# EAGLE design PCB design (EAGLE 9.5.2)
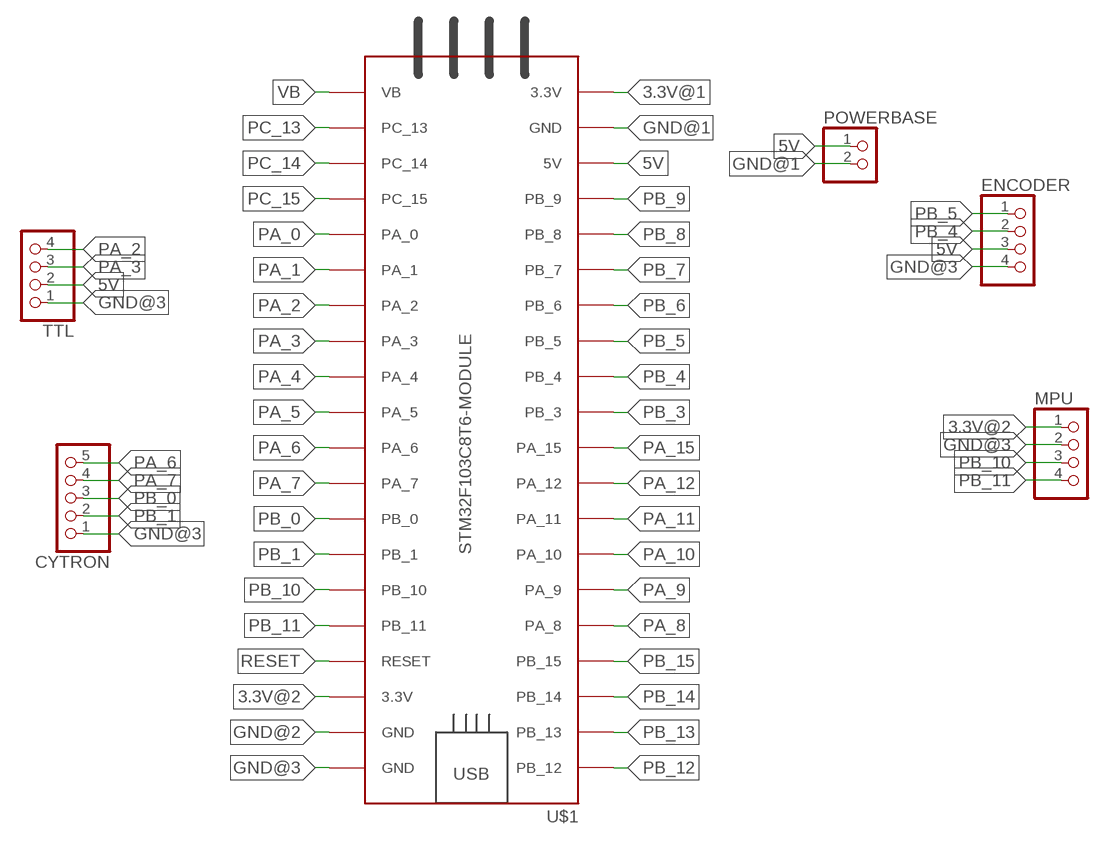
[diagram p0: schematic, sheet 1]

## Parts
CYTRON  PINHD-1X5  [1X05]
ENCODER  PINHD-1X4  [1X04]
MPU  PINHD-1X4  [1X04]
POWERBASE  PINHD-1X2  [1X02]
TTL  PINHD-1X4  [1X04]
U$1  STM32F103C8T6-MODULE  [STM32F103C8T6-MODULE]

## Nets
3.3V@1: U$1.3.3V_1(3.3V)
3.3V@2: MPU.1 U$1.3.3V_2(3.3V)
5V: ENCODER.3 POWERBASE.1 TTL.2 U$1.5V
GND@1: POWERBASE.2 U$1.GND_1(GND)
GND@2: U$1.GND_2(GND)
GND@3: CYTRON.1 ENCODER.4 MPU.2 TTL.1 U$1.GND_3(GND)
PA_0: U$1.PA_0
PA_1: U$1.PA_1
PA_2: TTL.4 U$1.PA_2
PA_3: TTL.3 U$1.PA_3
PA_4: U$1.PA_4
PA_5: U$1.PA_5
PA_6: CYTRON.5 U$1.PA_6
PA_7: CYTRON.4 U$1.PA_7
PA_8: U$1.PA_8
PA_9: U$1.PA_9
PA_10: U$1.PA_10
PA_11: U$1.PA_11
PA_12: U$1.PA_12
PA_15: U$1.PA_15
PB_0: CYTRON.3 U$1.PB_0
PB_1: CYTRON.2 U$1.PB_1
PB_3: U$1.PB_3
PB_4: ENCODER.2 U$1.PB_4
PB_5: ENCODER.1 U$1.PB_5
PB_6: U$1.PB_6
PB_7: U$1.PB_7
PB_8: U$1.PB_8
PB_9: U$1.PB_9
PB_10: MPU.3 U$1.PB_10
PB_11: MPU.4 U$1.PB_11
PB_12: U$1.PB_12
PB_13: U$1.PB_13
PB_14: U$1.PB_14
PB_15: U$1.PB_15
PC_13: U$1.PC_13
PC_14: U$1.PC_14
PC_15: U$1.PC_15
RESET: U$1.RESET
VB: U$1.VB

## Library data of the parts
CYTRON = MIA_LIBRARY-2-2-2:PINHD-1X5: PIN HEADER
ENCODER MPU TTL = MIA_LIBRARY-2-2-2:PINHD-1X4: PIN HEADER
POWERBASE = MIA_LIBRARY-2-2-2:PINHD-1X2: PIN HEADER
U$1 = MIA_LIBRARY-2-2-2:STM32F103C8T6-MODULE: STM32F103C8T6 module with ARM Cortex-3, 20kB SRAM, 64kB Flash, 72MHz

## Board
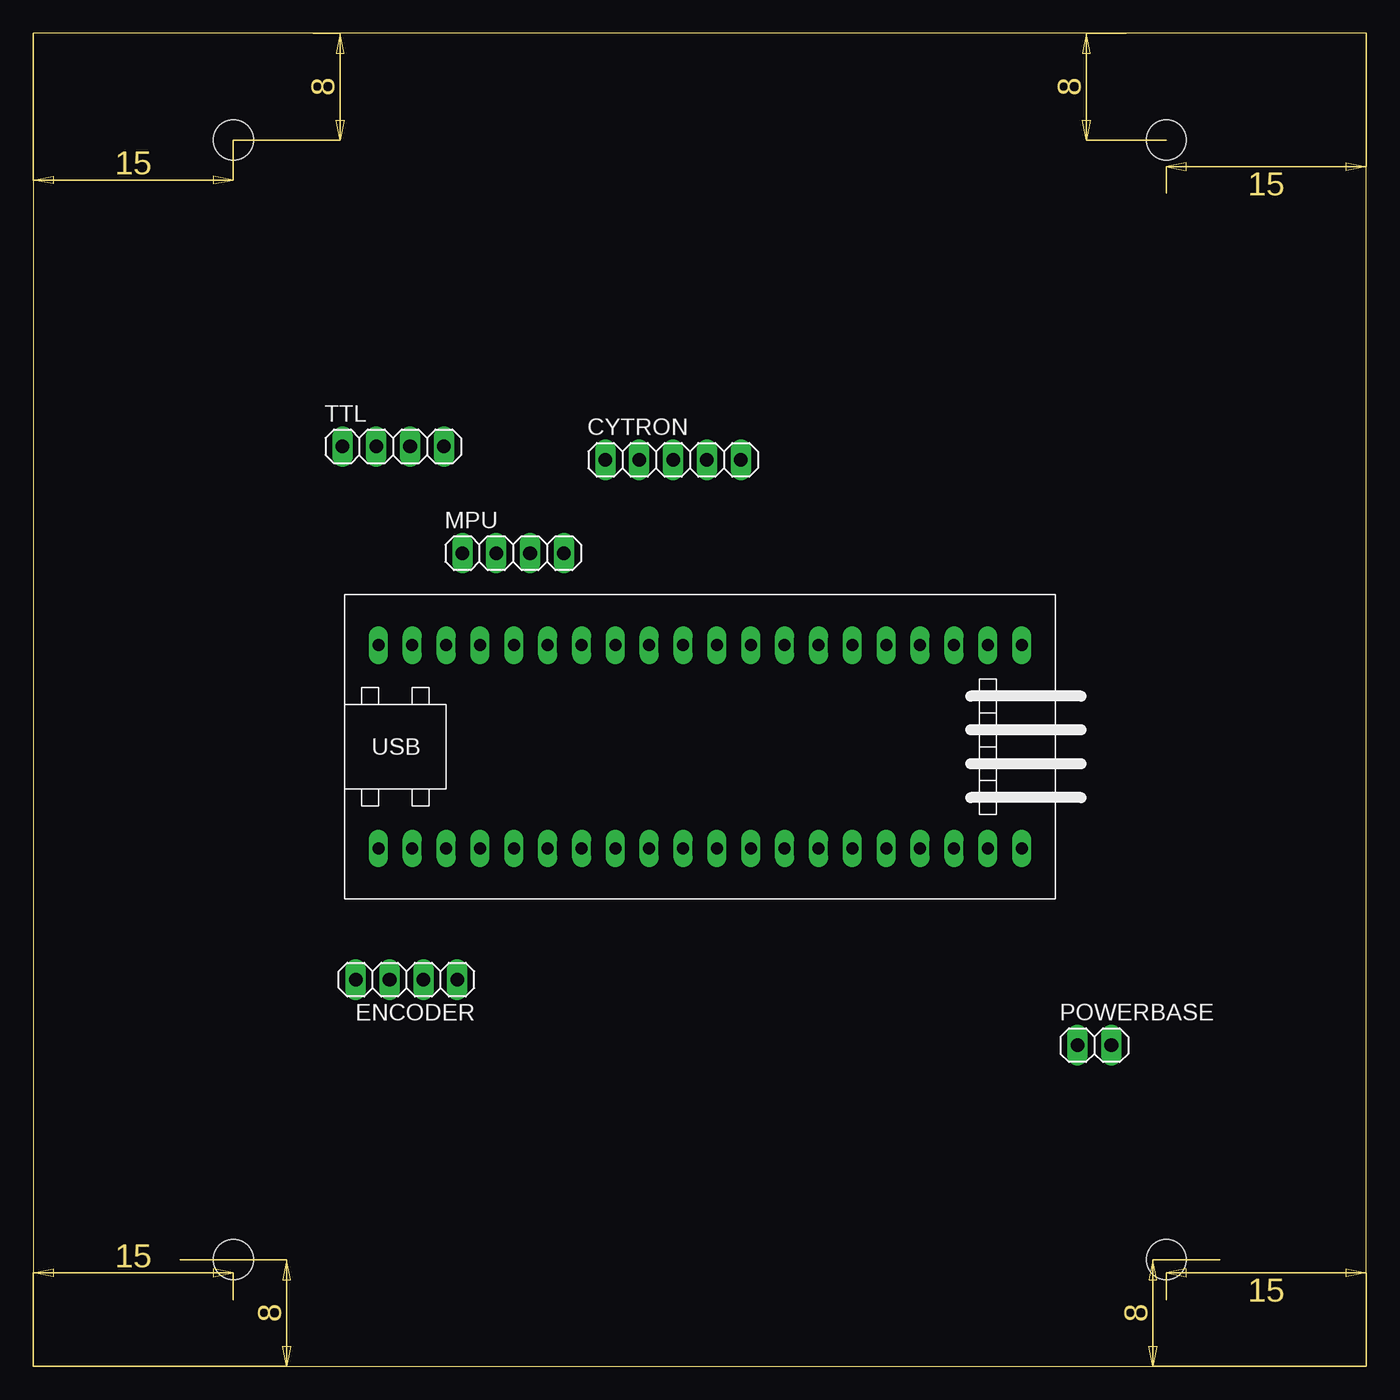
[diagram p1: board, top side]
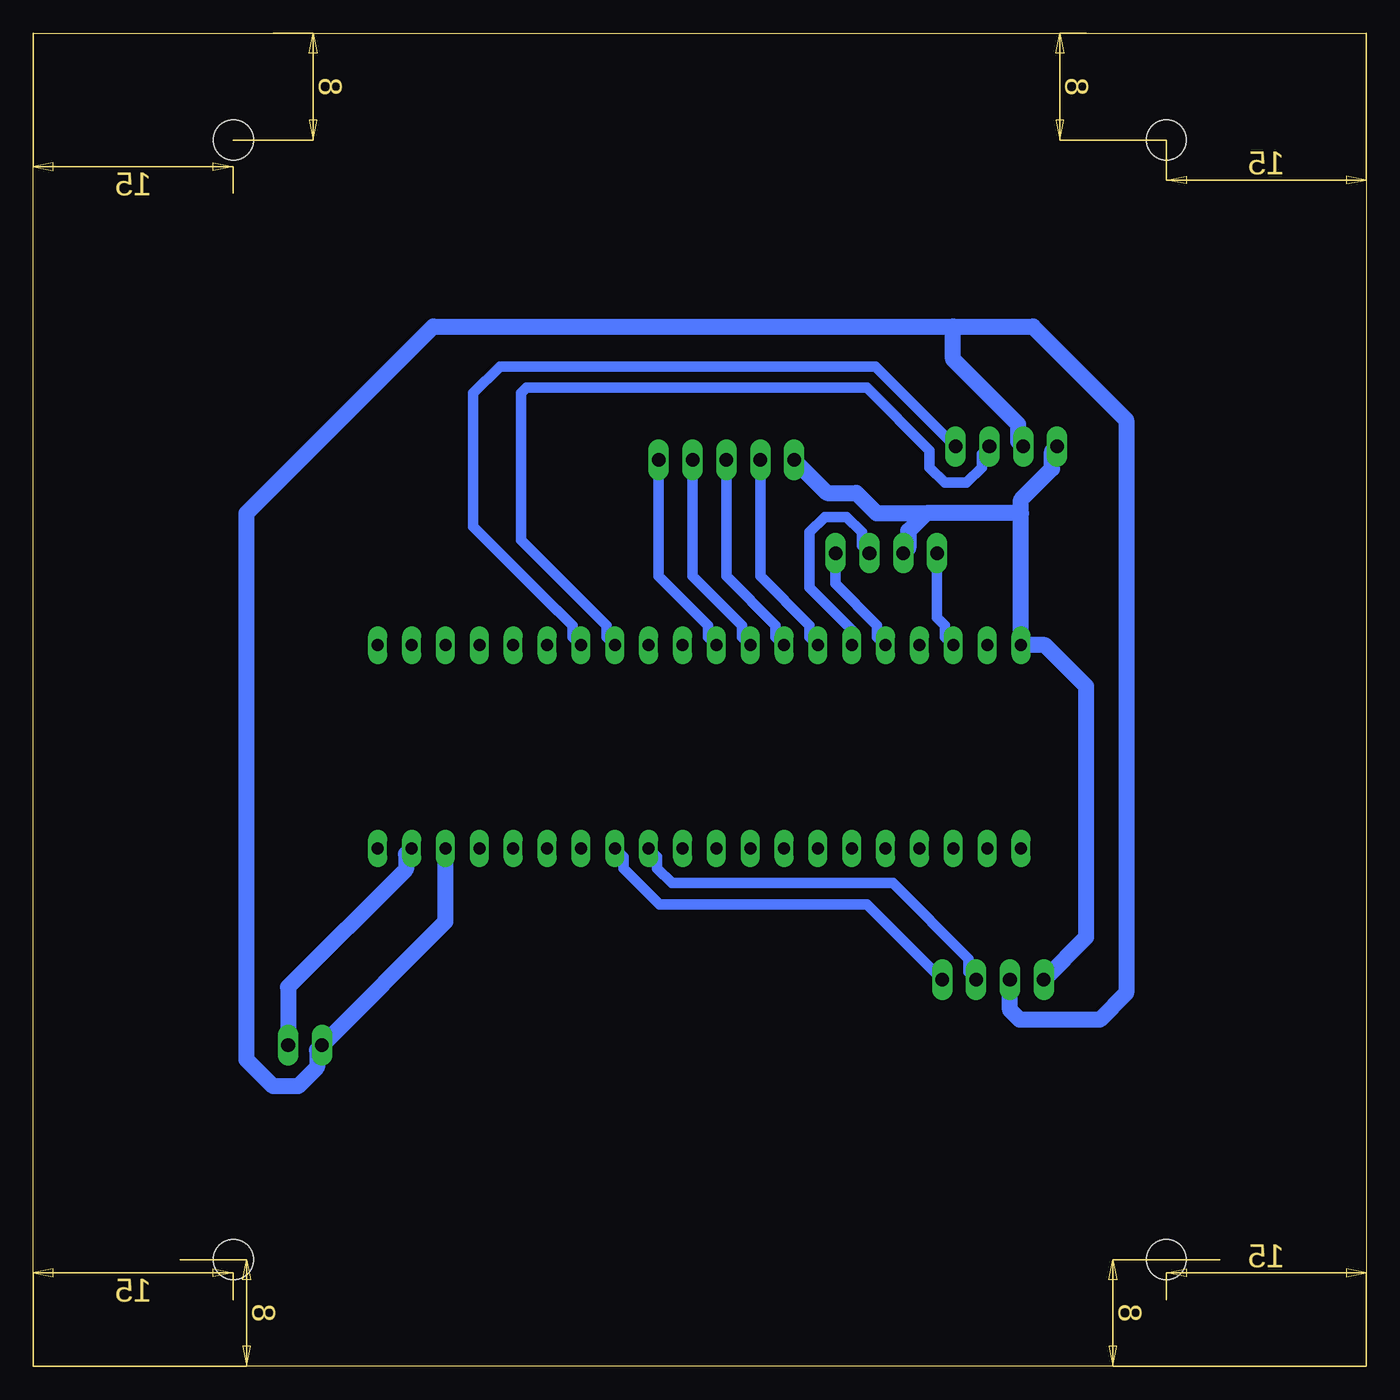
[diagram p2: board, bottom side, seen from below]

Size 100 x 100 mm. Coordinates in mm from the lower left corner, seen from the top.
Outline: 0,0 100,0 100,100 0,100 0,0
Copper layers (1*16): Top 0.035mm / dielectric 1.5mm / Bottom 0.035mm
Design rules "default *": minimum track width 0.8mm, minimum drill 0.35mm, track to track 0.8mm, track to pad 0.8mm, pad to pad 6mil, via to via 6mil, smd to smd 6mil, copper to edge 0.8mm, drill to drill 6mil, minimum pad ring 10mil, minimum via ring 8mil, stop-mask expansion 4mil, vias tented up to drill 0mil, thermal gap 10mil
Holes 3 mm at 15,92 85,92 15,8 85,8

### Footprints (pad centres in the part's own frame; a part is rotated, then mirrored left to right if it is on the bottom)
1X05 = drill 1.016 long: 1 -5.08,0; 2 -2.54,0; 3 0,0; 4 2.54,0; 5 5.08,0
1X04 = drill 1.016 long: 1 -3.81,0; 2 -1.27,0; 3 1.27,0; 4 3.81,0
1X02 = drill 1.016 long: 1 -1.27,0; 2 1.27,0
STM32F103C8T6-MODULE = drill 0.9 long: 3.3V_1 25.4,-7.62; 3.3V_2 -17.78,7.62; 5V 20.32,-7.62; GND_1 22.86,-7.62; GND_2 -20.32,7.62; GND_3 -22.86,7.62; PA_0 15.24,7.62; PA_1 12.7,7.62; PA_2 10.16,7.62; PA_3 7.62,7.62; PA_4 5.08,7.62; PA_5 2.54,7.62; PA_6 0,7.62; PA_7 -2.54,7.62; PA_8 -12.7,-7.62; PA_9 -10.16,-7.62; PA_10 -7.62,-7.62; PA_11 -5.08,-7.62; PA_12 -2.54,-7.62; PA_15 0,-7.62; PB_0 -5.08,7.62; PB_1 -7.62,7.62; PB_3 2.54,-7.62; PB_4 5.08,-7.62; PB_5 7.62,-7.62; PB_6 10.16,-7.62; PB_7 12.7,-7.62; PB_8 15.24,-7.62; PB_9 17.78,-7.62; PB_10 -10.16,7.62; PB_11 -12.7,7.62; PB_12 -22.86,-7.62; PB_13 -20.32,-7.62; PB_14 -17.78,-7.62; PB_15 -15.24,-7.62; PC_13 22.86,7.62; PC_14 20.32,7.62; PC_15 17.78,7.62; RESET -15.24,7.62; VB 25.4,7.62

### Placement (x,y rotation side)
CYTRON  48,68 0 top
ENCODER  28,29 180 top
MPU  36,61 0 top
POWERBASE  79.61,24.08 0 top
TTL  27,69 0 top
U$1  48.75,46.47 0 top

### Tracks (layer width: path | path; a pad name or v marks a point on that pad's centre or on a via)
3.3V@2
  Bottom 0.8: MPU.1 32.19,56.16 31.61,55.58 31.61,54.72 U$1.3.3V_2
5V
  Bottom 1.2: 31,78 70,78 84,64 84,23 82,21 80.15,21 78.72,22.43 78.72,23.71 POWERBASE.1 69.07,33.35 U$1.5V | 31,78 25,78 18,71 18,28 20,26 26,26 26.73,26.73 ENCODER.3 | TTL.2 26.11,69.38 26.11,70.66 31,75.55 31,78
GND@1
  Bottom 1.2: U$1.GND_1 72.05,38.41 72.05,37.27 80.88,28.44 POWERBASE.2
GND@3
  Bottom 1.2: ENCODER.4 21,32.19 21,51 24.09,54.09 U$1.GND_3 25.89,64 | TTL.1 23.57,68.62 23.57,67.34 25.89,65.02 25.89,64 | MPU.2 34.35,61.38 34.35,62.66 33.01,64 | 25.89,64 33.01,64 | CYTRON.1 40.44,65.52 38.25,65.52 36.73,64 33.01,64
PA_2
  Bottom 0.8: TTL.4 36.81,75 65,75 67,73 67,63 60.7,56.7 60.66,56.7 59.55,55.58 59.55,54.72 U$1.PA_2
PA_3
  Bottom 0.8: TTL.3 28.85,68.42 28.85,67.42 30,66.28 31.62,66.28 32.77,67.42 32.77,68.7 37.47,73.4 63,73.4 63.4,73 63.4,61.97 57.01,55.58 57.01,54.72 U$1.PA_3
PA_6
  Bottom 0.8: U$1.PA_6 49.39,54.72 49.39,55.58 53.08,59.27 CYTRON.5
PA_7
  Bottom 0.8: U$1.PA_7 46.85,54.72 46.85,55.58 50.54,59.27 CYTRON.4
PB_0
  Bottom 0.8: U$1.PB_0 44.31,54.72 44.31,55.58 48,59.27 CYTRON.3
PB_1
  Bottom 0.8: U$1.PB_1 41.77,54.72 41.77,55.58 45.46,59.27 CYTRON.2
PB_4
  Bottom 0.8: ENCODER.2 29.85,29.58 29.85,30.57 35.51,36.24 52.08,36.24 53.2,37.35 53.2,38.21 U$1.PB_4
PB_5
  Bottom 0.8: ENCODER.1 37.45,34.64 53.02,34.64 55.74,37.35 55.74,38.21 U$1.PB_5
PB_10
  Bottom 0.8: U$1.PB_10 38.59,55.22 41.77,58.4 41.77,62.58 40.62,63.72 39,63.72 37.85,62.58 37.85,61.58 MPU.3
PB_11
  Bottom 0.8: U$1.PB_11 36.69,54.72 36.69,55.58 39.81,58.7 MPU.4